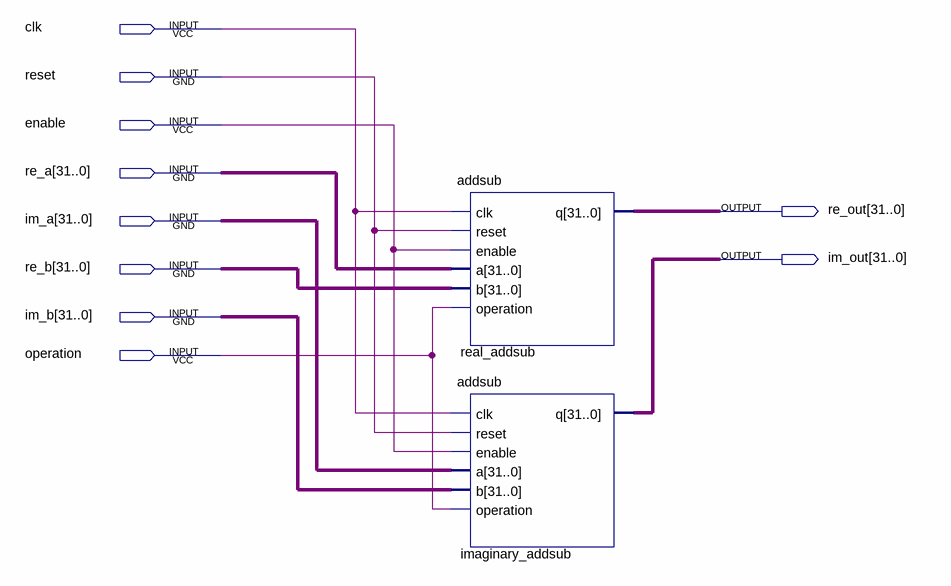
[diagram p0: schematic sheet]
// Quartus schematic complex_addsub.bdf as structural Verilog: 2 symbols, 10 pins
module complex_addsub (
  input  clk,
  input  reset,
  input  enable,
  input  [31:0] re_a,
  input  [31:0] im_a,
  input  [31:0] re_b,
  input  [31:0] im_b,
  input  operation,
  output [31:0] re_out,
  output [31:0] im_out
);

  addsub real_addsub (.clk(clk), .reset(reset), .enable(enable), .a(re_a), .b(re_b), .operation(operation), .q(re_out));
  addsub imaginary_addsub (
    .clk(clk), .reset(reset), .enable(enable), .a(im_a), .b(im_b), .operation(operation), .q(im_out));
endmodule
